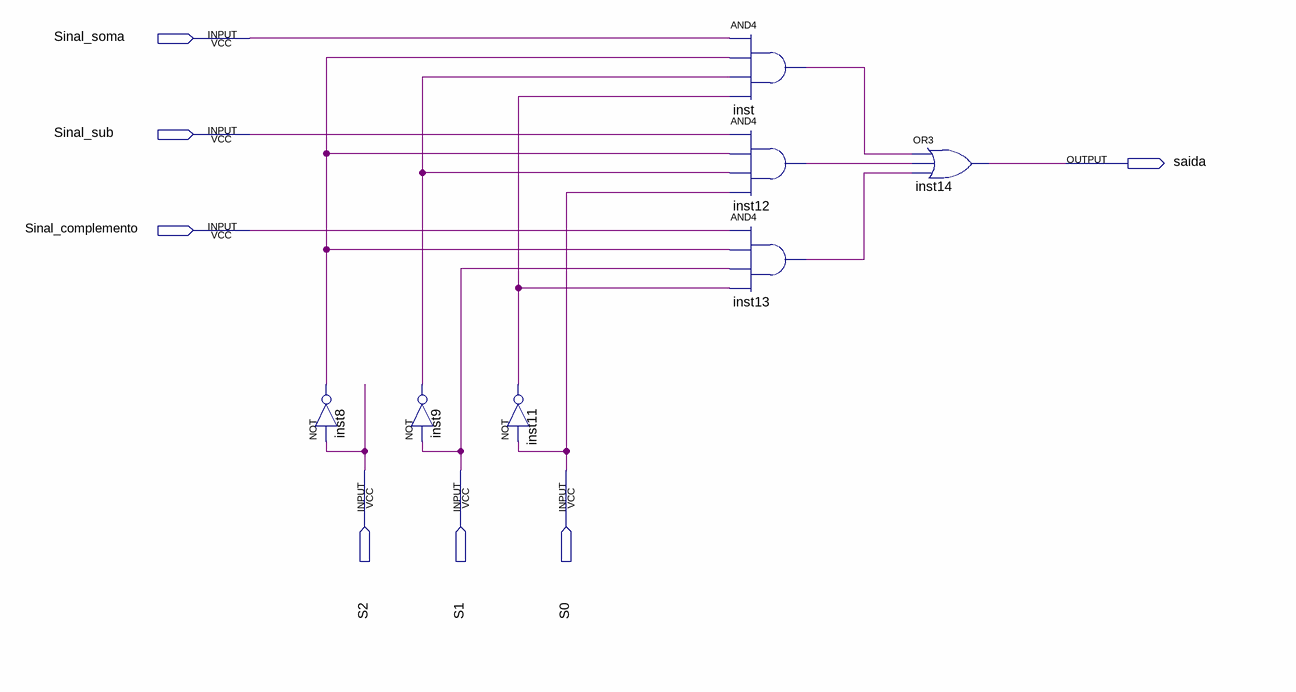
[diagram p0: schematic sheet]
// Quartus schematic mux_sinal.bdf as structural Verilog: 7 symbols, 7 pins
module mux_sinal (
  input  Sinal_soma,
  input  Sinal_sub,
  input  Sinal_complemento,
  input  S2,
  input  S1,
  input  S0,
  output saida
);

  wire inst8_out, inst9_out, inst11_out, inst12_out, inst13_out, inst_out;

  not inst8 (inst8_out, S2);
  not inst9 (inst9_out, S1);
  not inst11 (inst11_out, S0);
  and inst (inst_out, Sinal_soma, inst8_out, inst9_out, inst11_out);
  and inst12 (inst12_out, Sinal_sub, inst8_out, inst9_out, S0);
  and inst13 (inst13_out, Sinal_complemento, inst8_out, S1, inst11_out);
  or inst14 (saida, inst_out, inst12_out, inst13_out);
endmodule
